# Altium schematic sheet BG1094_TopLevel.SchDoc: =project_title
size Tabloid; PageSetup: Record=PageOptions|CenterHorizontal=True|CenterVertical=True|PrintScale=0.73|XCorrection=1.00|YCorrection=1.00|PrintKind=0|BorderSize=5000000|LeftOffset=0|BottomOffset=0|Orientation=2|PaperLength=1000|PaperWidth=1000|Scale=100|PaperSource=7|PrintQuality=-4|MediaType=1|DitherType=10|PaperKind=A4|PrintScaleMode=1; CompanyName: Luxonis Holding; Organization: Luxonis Holding; Address1: 1925 Harmony Park Drive; Address2: Westminster, CO; Address3: 80234; Address4: United States; SheetNumber: 1; SheetTotal: 5
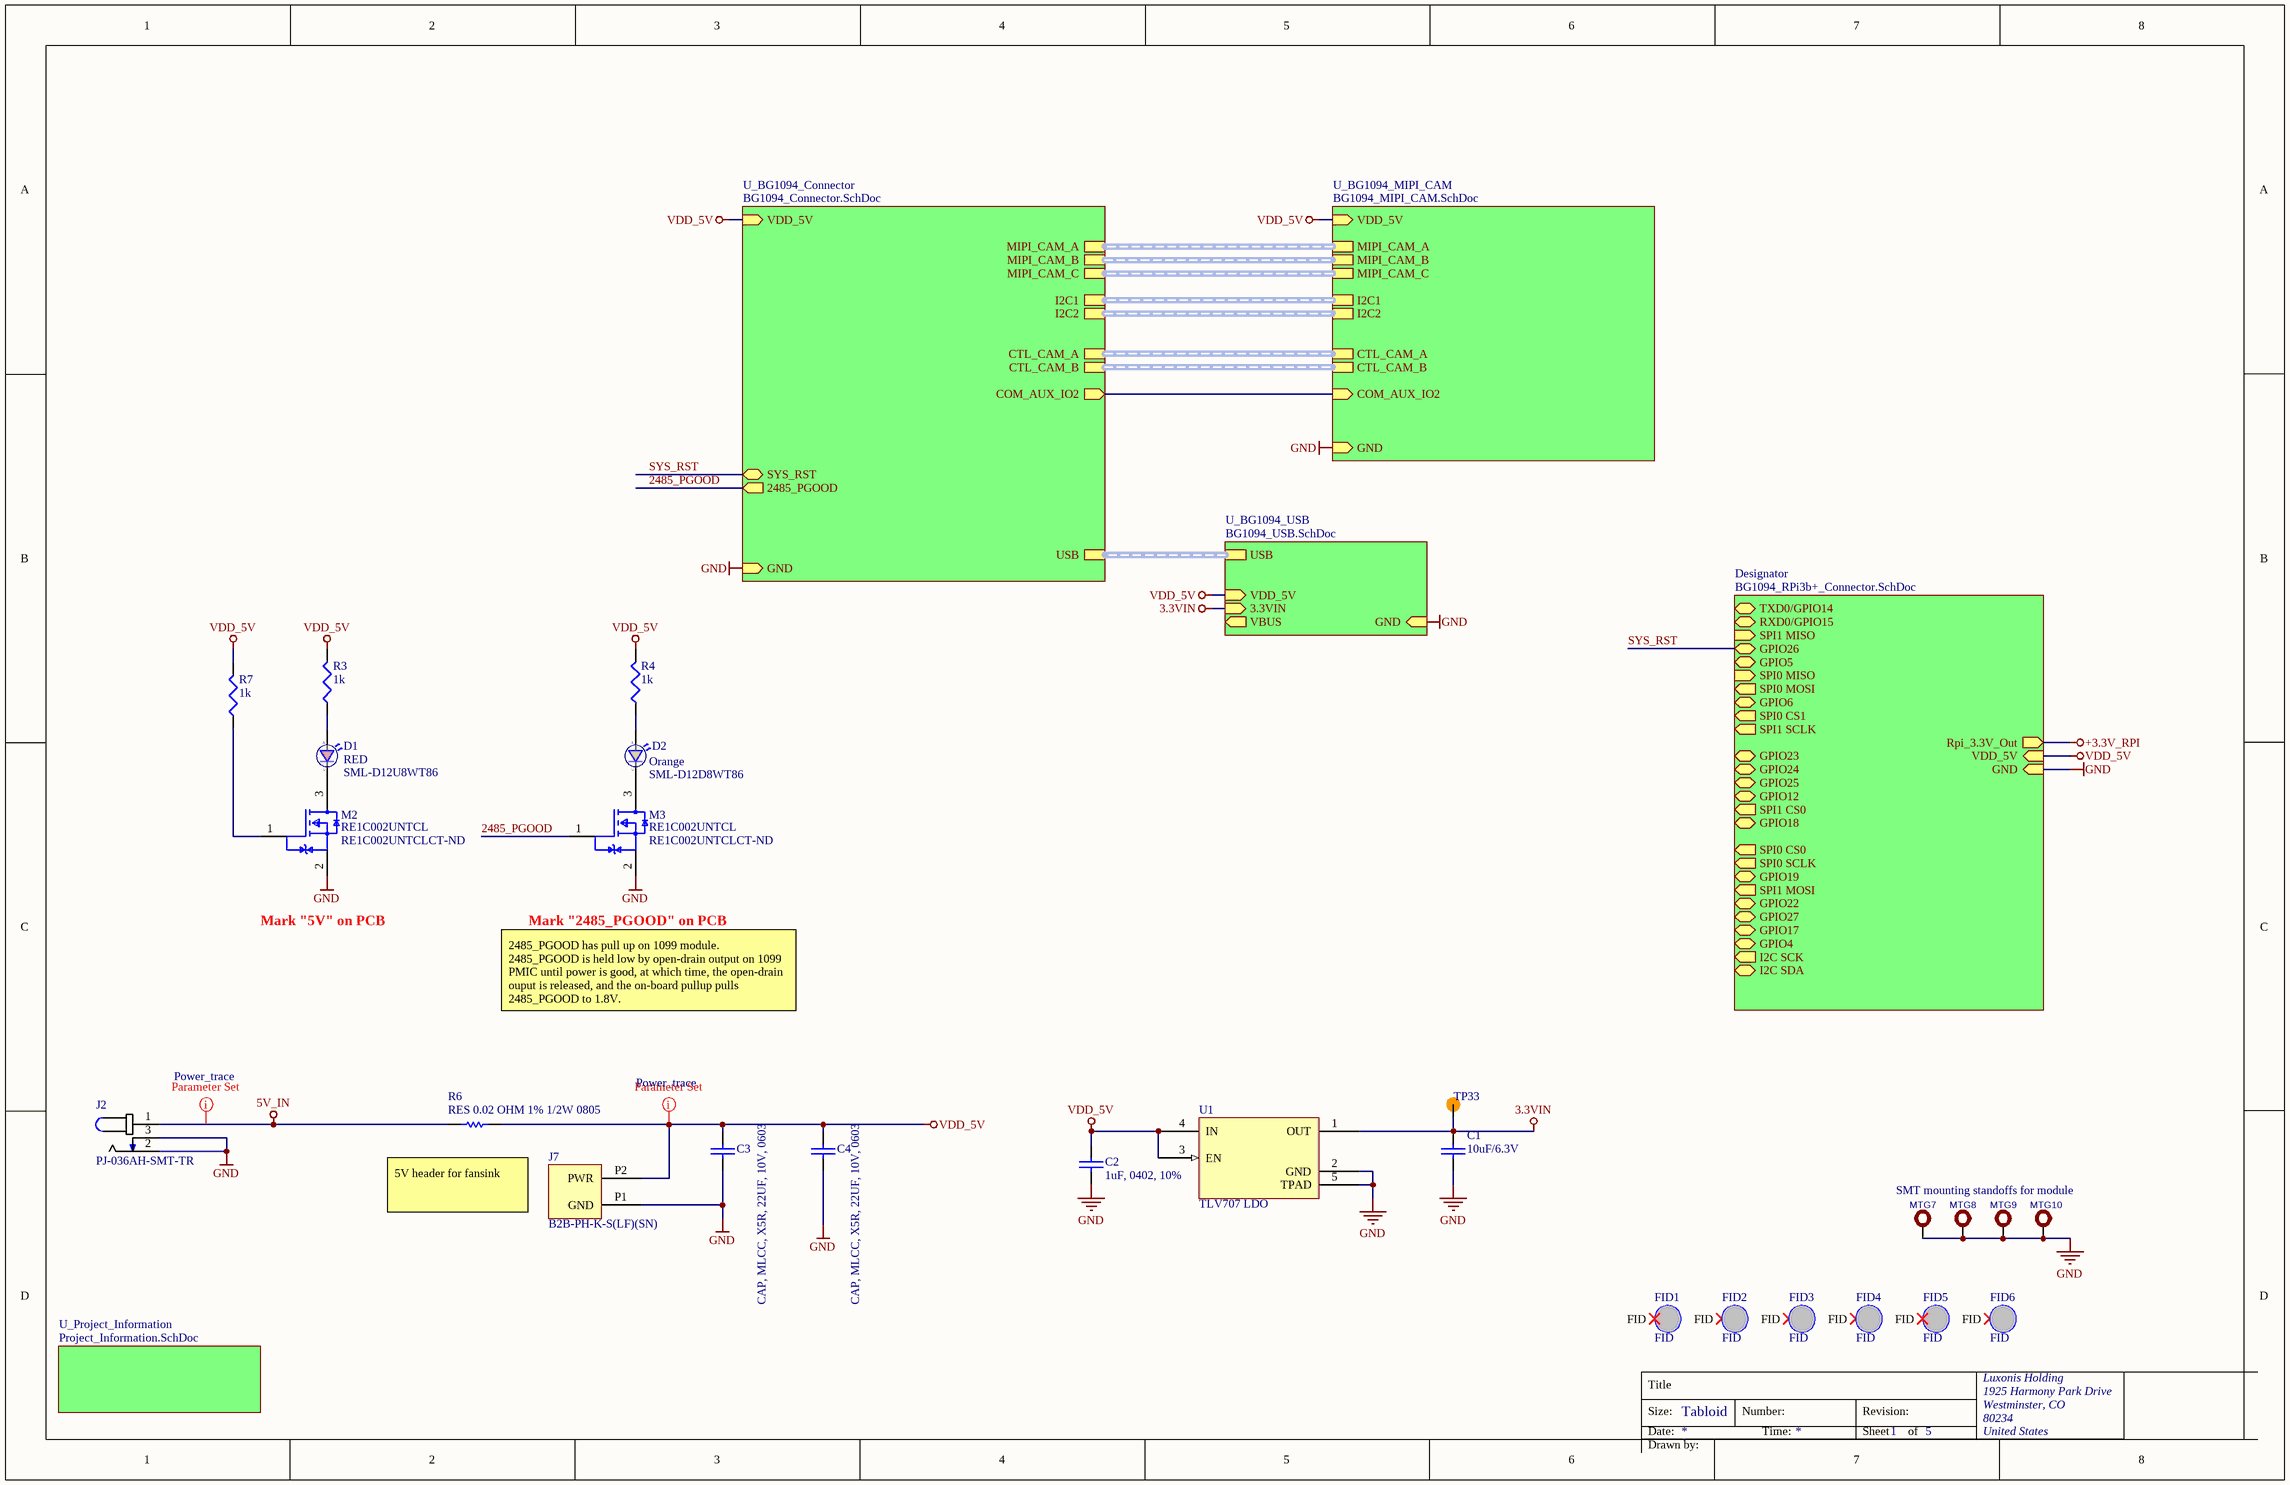
[diagram p0: BG1094_TopLevel.SchDoc]

## Parts
C1  10uF/6.3V  [CAPC0402(1005)70_N]
C2  1uF, 0402, 10%  [CAPC0402(1005)70_N]
C3  CAP, MLCC, X5R, 22UF, 10V, 0603  [CAPC0603(1608)100_N]
C4  CAP, MLCC, X5R, 22UF, 10V, 0603  [CAPC0603(1608)100_N]
D1  RED  Manufacturer Part Number 1: SML-D12U8WT86  [LED_0603]
D2  SML-D12D8WT86  Color: Orange  [LED_0603]
FID1  FID  [FIDUCIAL_1MM]  (no BOM)
FID2  FID  [FIDUCIAL_1MM]  (no BOM)
FID3  FID  [FIDUCIAL_1MM]  (no BOM)
FID4  FID  [FIDUCIAL_1MM]  (no BOM)
FID5  FID  [FIDUCIAL_1MM]  (no BOM)
FID6  FID  [FIDUCIAL_1MM]  (no BOM)
J2  PJ-036AH-SMT-TR  [CUI_PJ-036AH-SMT-TR]
J7  B2B-PH-K-S(LF)(SN)  [*JST_B2B-PH-K-S(LF)(SN)]
M2  RE1C002UNTCL  Supplier Part Number 1: RE1C002UNTCLCT-ND  [SOT-416FL]
M3  RE1C002UNTCL  Supplier Part Number 1: RE1C002UNTCLCT-ND  [SOT-416FL]
MTG7  MTG-HOLE  [STANDOFF_M2X0.4_3MM]  (value not drawn)
MTG8  MTG-HOLE  [STANDOFF_M2X0.4_3MM]  (value not drawn)
MTG9  MTG-HOLE  [STANDOFF_M2X0.4_3MM]  (value not drawn)
MTG10  MTG-HOLE  [STANDOFF_M2X0.4_3MM]  (value not drawn)
R3  1k  [RESC0402(1005)_N]
R4  1k  [RESC0402(1005)_N]
R6  RES 0.02 OHM 1% 1/2W 0805  [RESC0805(2012)_M]
R7  1k  [RESC0402(1005)_N]
TP33  TP_SMD  [TP_0.75MM_SMD_NO-SILK]  (value not drawn)  (no BOM)
U1  TLV707 LDO  [DFN65P100X40-4L]

## Sub-sheets
Designator = BG1094_RPi3b+_Connector.SchDoc: SPI1 MISO (in), GPIO26 (bidir), GPIO5 (bidir), SPI0 MISO (in), SPI0 MOSI (out), GPIO6 (bidir), SPI0 CS1 (out), SPI1 SCLK (out), GPIO23 (bidir), GPIO24 (bidir), GPIO25 (bidir), GPIO12 (bidir), SPI1 CS0 (out), GPIO18 (bidir), SPI0 CS0 (out), SPI0 SCLK (out), GPIO19 (bidir), SPI1 MOSI (out), GPIO22 (bidir), GPIO27 (bidir), GPIO17 (bidir), GPIO4 (bidir), I2C SCK (out), I2C SDA (bidir), Rpi_3.3V_Out (out), VDD_5V (in), GND (in), RXD0/GPIO15 (bidir), TXD0/GPIO14 (bidir)
U_BG1094_Connector = BG1094_Connector.SchDoc: MIPI_CAM_B (harness MIPI_CAM_B), MIPI_CAM_A (harness MIPI_CAM_A), MIPI_CAM_C (harness MIPI_CAM_C), I2C2 (harness I2C2), I2C1 (harness I2C1), SYS_RST (bidir), CTL_CAM_A (harness CTL_CAM_A), CTL_CAM_B (harness CTL_CAM_B), USB (harness USB), GND (in), VDD_5V (in), 2485_PGOOD (out), COM_AUX_IO2 (out)
U_BG1094_MIPI_CAM = BG1094_MIPI_CAM.SchDoc: MIPI_CAM_B (harness MIPI_CAM_B), I2C2 (harness I2C2), I2C1 (harness I2C1), MIPI_CAM_A (harness MIPI_CAM_A), MIPI_CAM_C (harness MIPI_CAM_C), CTL_CAM_A (harness CTL_CAM_A), CTL_CAM_B (harness CTL_CAM_B), GND (in), VDD_5V (in), COM_AUX_IO2 (in)
U_BG1094_USB = BG1094_USB.SchDoc: USB (harness USB), VBUS (out), GND (in), VDD_5V (in), 3.3VIN (in)
U_Project_Information = Project_Information.SchDoc: no entries

## Nets
3.3VIN: C1.2 TP33.1 U1.1(OUT) ; sheet U_BG1094_USB/3.3VIN
5V_IN: J2.1 R6.2
+3.3V_RPI: sheet Designator/Rpi_3.3V_Out
GND: C1.1 C2.2 C3.2 C4.2 J2.2 J2.3 J7.P1(GND) M2.2(Source) M3.2(Source) MTG7.1 MTG8.1 MTG9.1 MTG10.1 U1.2(GND) U1.5(TPAD) ; sheet U_BG1094_Connector/GND, sheet U_BG1094_MIPI_CAM/GND, sheet U_BG1094_USB/GND, sheet Designator/GND
VDD_5V: C2.1 C3.1 C4.1 J7.P2(PWR) R3.2 R4.2 R6.1 R7.2 U1.3(EN) U1.4(IN) ; sheet U_BG1094_Connector/VDD_5V, sheet U_BG1094_MIPI_CAM/VDD_5V, sheet U_BG1094_USB/VDD_5V, sheet Designator/VDD_5V
2485_PGOOD: M3.1(Gate) ; sheet U_BG1094_Connector/2485_PGOOD
SYS_RST: sheet U_BG1094_Connector/SYS_RST, sheet Designator/GPIO26
NetD1_1: D1.1(C) M2.3(Drain)
NetD1_2: D1.2(A) R3.1
NetD2_1: D2.1(C) M3.3(Drain)
NetD2_2: D2.2(A) R4.1
NetM2_1: M2.1(Gate) R7.1
(unnamed): sheet U_BG1094_Connector/COM_AUX_IO2, sheet U_BG1094_MIPI_CAM/COM_AUX_IO2

Not connected (* = marked no-connect by the designer): FID1 FID*; FID2 FID*; FID3 FID*; FID4 FID*; FID5 FID*; FID6 FID*

## Buses and harness runs
harness sheet U_BG1094_Connector/CTL_CAM_A = sheet U_BG1094_MIPI_CAM/CTL_CAM_A
harness sheet U_BG1094_Connector/CTL_CAM_B = sheet U_BG1094_MIPI_CAM/CTL_CAM_B
harness sheet U_BG1094_Connector/I2C1 = sheet U_BG1094_MIPI_CAM/I2C1
harness sheet U_BG1094_Connector/I2C2 = sheet U_BG1094_MIPI_CAM/I2C2
harness sheet U_BG1094_Connector/MIPI_CAM_A = sheet U_BG1094_MIPI_CAM/MIPI_CAM_A
harness sheet U_BG1094_Connector/MIPI_CAM_B = sheet U_BG1094_MIPI_CAM/MIPI_CAM_B
harness sheet U_BG1094_Connector/MIPI_CAM_C = sheet U_BG1094_MIPI_CAM/MIPI_CAM_C
harness sheet U_BG1094_Connector/USB = sheet U_BG1094_USB/USB

## Layout directives
net class Power_trace: 5V_IN, VDD_5V

## Notes on the sheet
- Mark "5V" on PCB
- Mark "2485_PGOOD" on PCB
- 2485_PGOOD has pull up on 1099 module. 2485_PGOOD is held low by open-drain output on 1099 PMIC until power is good, at which time, the open-drain ouput is released, and the on-board pullup pulls 2485_PGOOD to 1.8V.
- (near R6) 5V header for fansink
- SMT mounting standoffs for module
- Title
- Size:
- Date:
- Tabloid
- Number:
- Time:
- Revision:
- Sheet
- of
- Drawn by:

## Library data of the parts
C1 = CAP: SMD Multilayer Ceramic Capacitor, 0402 [1005 Metric], 10 µF, 6.3 V, ± 20%, X5R; MAN: MuRata; MAN PN: GRM155R60J106ME44D; ICCO PN: MV226007; DIST: Farnell; DIST PN: 2218854RL
C2 = CL05A105KP5NNNC: Cap Ceramic 1uF 10V X5R 10% SMD 0402 85C Paper T/R; Manufacturer: Samsung; Supplier 1: Digi-Key; Manufacturer Part Number: CL05A105KP5NNNC; Stock 1: 13690251; Pricing 1: 1 = 0.10000, 10 = 0.04200, 100 = 0.01880, 500 = 0.01340, 1000 = 0.01053, 2500 = 0.00958, 5000 = 0.00881 (USD); RoHS: Yes; Mount: Surface Mount; Case/Package: 0402; Case Code (Metric): 1005; Case Code (Imperial): 0402; Material: Ceramic; Contact Plating: Tin; Min Operating Temperature: -55°C; Max Operating Temperature: 85°C; Capacitance: 1uF; Tolerance: 10%; Packaging: Tape and Reel; Voltage Rating: 10V; Dielectric: X5R; Package Quantity: 1; Length: 1mm; Height: 0.5mm; Width: 0.02inch; Thickness: 0.022inch; Depth: 0.5mm; Radiation Hardening: No; ComponentLink1URL: https://datasheet.ciiva.com/15195/getdatasheetpartid-358390-15195630.pdf?src-supplier=Verical; ComponentLink1Description: https://datasheet.ciiva.com/15195/getdatasheetpartid-358390-15195630.pdf?src-supplier=Verical; ComponentLink2URL: https://datasheet.ciiva.com/29198/459159-da-01-en-vs-kondensator-0402-29198341.pdf?src-supplier=Conrad; ComponentLink2Description: https://datasheet.ciiva.com/29198/459159-da-01-en-vs-kondensator-0402-29198341.pdf?src-supplier=Conrad
C3 C4 = GRM188R61A226ME15D: Manufacturer 1: *
D1 = LED_RED_0603: LED RED DIFFUSED 0603 SMD; Manufacturer 1: Rohm; Lens Style: Rectangular,Diffused,Colorless; Forward Current: 20mA; Forward Voltage: 2.2V; Luminous Intensity: 63mcd; Dominant Wavelength: 620nm; Number of LEDs: 1; Viewing Angle: 160°; Lens Color: White,Clear,Diffused; Supplier 1: Digi-Key; Stock 1: 34516; Pricing 1: 1=0.33000, 10=0.23900, 100=0.11340, 500=0.07560, 1000=0.05922 (USD); Mount: Surface Mount; Case/Package: 0603; Number of Pins: 2; Case Code (Metric): 1608; Case Code (Imperial): 0603; Min Operating Temperature: -40°C; Max Operating Temperature: 85°C; Packaging: Tape and Reel; Wavelength: 620nm; Package Quantity: 1; Test Current: 20mA; Lens Transparency: Diffused; Length: 1.6mm; Height: 0.65mm; Width: 0.8mm; Radiation Hardening: No; REACH SVHC: No SVHC; Lead Free: Lead Free; ComponentLink1URL: https://datasheet.ciiva.com/11774/0900766b80df3ada-11774020.pdf?src-supplier=RSComponents; ComponentLink1Description: https://datasheet.ciiva.com/11774/0900766b80df3ada-11774020.pdf?src-supplier=RSComponents; ComponentLink2URL: https://datasheet.ciiva.com/2110/sml-d1-2110375.pdf?src-supplier=Digi-Key; ComponentLink2Description: https://datasheet.ciiva.com/2110/sml-d1-2110375.pdf?src-supplier=Digi-Key; ComponentLink3URL: https://datasheet.ciiva.com/2110/sml-d1-2110376.pdf?src-supplier=Digi-Key; ComponentLink3Description: https://datasheet.ciiva.com/2110/sml-d1-2110376.pdf?src-supplier=Digi-Key; ComponentLink4URL: https://datasheet.ciiva.com/2110/sml-d1-2110377.pdf?src-supplier=Digi-Key; ComponentLink4Description: https://datasheet.ciiva.com/2110/sml-d1-2110377.pdf?src-supplier=Digi-Key; ComponentLink5URL: https://datasheet.ciiva.com/9324/sml-d1-9324826.pdf?src-supplier=Avnet; ComponentLink5Description: https://datasheet.ciiva.com/9324/sml-d1-9324826.pdf?src-supplier=Avnet; RoHS: Yes; Color: Red; Illumination Color: Red; ComponentLink6URL: https://datasheet.ciiva.com/17420/sml-d1-17420939.pdf?src-supplier=Avnet+Europe; ComponentLink6Description: https://datasheet.ciiva.com/17420/sml-d1-17420939.pdf?src-supplier=Avnet+Europe; Supplier Part Number 1: 511-1580-1-ND
D2 = LED_ORANGE_0603: LED ORANGE DIFFUSED 0603 SMD; Manufacturer 1: Rohm; Lens Color: White; Lens Style: Diffused,Colorless,Rectangular; Dominant Wavelength: 605nm; Number of LEDs: 1; Forward Voltage: 2.2V; Viewing Angle: 160°; Forward Current: 20mA; Luminous Intensity: 100mcd; Supplier 1: Digi-Key; Stock 1: 29355; Pricing 1: 1=0.33000, 10=0.23900, 100=0.11340, 500=0.07560, 1000=0.05922 (USD); RoHS: Yes; Mount: Surface Mount; Case/Package: 0603; Number of Pins: 2; Case Code (Metric): 1608; Case Code (Imperial): 0603; Min Operating Temperature: -40°C; Max Operating Temperature: 85°C; Package Quantity: 1; Packaging: Tape and Reel; Illumination Color: Orange; Test Current: 20mA; Lens Transparency: Diffused; Wavelength: 605nm; Length: 1.6mm; Height: 0.65mm; Width: 0.8mm; Radiation Hardening: No; REACH SVHC: Unknown; Lead Free: Lead Free; ComponentLink1URL: https://datasheet.ciiva.com/2115/sml-d1-2115577.pdf?src-supplier=Digi-Key; ComponentLink1Description: https://datasheet.ciiva.com/2115/sml-d1-2115577.pdf?src-supplier=Digi-Key; ComponentLink2URL: https://datasheet.ciiva.com/2115/sml-d1-2115578.pdf?src-supplier=Digi-Key; ComponentLink2Description: https://datasheet.ciiva.com/2115/sml-d1-2115578.pdf?src-supplier=Digi-Key; ComponentLink3URL: https://datasheet.ciiva.com/3161/sml-d1-3161418.pdf?src-supplier=Avnet; ComponentLink3Description: https://datasheet.ciiva.com/3161/sml-d1-3161418.pdf?src-supplier=Avnet; ComponentLink4URL: https://datasheet.ciiva.com/16387/sml-d1-16387850.pdf?src-supplier=Future+Electronics; ComponentLink4Description: https://datasheet.ciiva.com/16387/sml-d1-16387850.pdf?src-supplier=Future+Electronics; ComponentLink5URL: https://datasheet.ciiva.com/2115/sml-d1-2115579.pdf?src-supplier=Digi-Key; ComponentLink5Description: https://datasheet.ciiva.com/2115/sml-d1-2115579.pdf?src-supplier=Digi-Key; ComponentLink6URL: https://datasheet.ciiva.com/17419/sml-d1-17419886.pdf?src-supplier=Avnet+Europe; ComponentLink6Description: https://datasheet.ciiva.com/17419/sml-d1-17419886.pdf?src-supplier=Avnet+Europe; Supplier Part Number 1: 511-1577-1-ND; Manufacturer Part Number 1: SML-D12D8WT86
FID1-FID6 = FID: Fiducial mark; MAN PN: No part on PCB; MAN: Fiducial
J2 = PJ-036AH-SMT-TR: 2.0 x 6.3 mm, 5.0 A, Horizontal, Surface Mount (SMT), Dc Power Jack Connector; Manufacturer 1: CUI; Current Rating: 5A; Gender: Male; Shielding: Unshielded; Voltage Rating: 24V; Insulation Resistance: 100MR; Number of Conductors: 2; Supplier 1: Digi-Key; Manufacturer Part Number 1: PJ-036AH-SMT-TR; Stock 1: 14194; Pricing 1: 1=1.39000, 10=1.26100, 25=1.18400, 50=1.13260, 100=1.08110 (USD); RoHS: Yes; Mount: Surface Mount; Case/Package: SMD/SMT; Color: Black; Contact Material: Brass; Contact Plating: Silver; Housing Color: Black; Housing Material: Thermoplastic; Min Operating Temperature: -25°C; Max Operating Temperature: 85°C; Package Quantity: 1000; Termination: SMD/SMT; Connector Type: Jack; Contact Gender: Male; Packaging: Tape and Reel; Orientation: Horizontal; Lead Free: Lead Free; Flammability Rating: UL94 V-0; ComponentLink1URL: http://www.mouser.com/ds/2/670/pj-036ah-smt-516063.pdf?src-supplier=Mouser; ComponentLink1Description: http://www.mouser.com/ds/2/670/pj-036ah-smt-516063.pdf?src-supplier=Mouser; ComponentLink2URL: http://www.cui.com/Product/Resource/FuturePDF/PJ-036AH-SMT.pdf?src-supplier=Future+Electronics; ComponentLink2Description: http://www.cui.com/Product/Resource/FuturePDF/PJ-036AH-SMT.pdf?src-supplier=Future+Electronics; ComponentLink3URL: https://www.cui.com/product/resource/digikeypdf/pj-036ah-smt-tr.pdf?src-supplier=Digi-Key; ComponentLink3Description: https://www.cui.com/product/resource/digikeypdf/pj-036ah-smt-tr.pdf?src-supplier=Digi-Key; Supplier Part Number 1: CP-036AHPJCT-ND
J7 = B2B-PH-K-S(LF)(SN): CONN HEADER VERT 2POS 2MM; Manufacturer: JST; Number of Positions: 2; Connector Type: Male Pin; Current Rating: 2A; Gender: Male; Contact Resistance: 20mR; Insulation Resistance: 1MR; Voltage Rating: 100V; Supplier 1: Digi-Key; Manufacturer Part Number: B2B-PH-K-S(LF)(SN); Stock 1: 216199; Pricing 1: 1 = 0.170000, 10 = 0.162000, 100 = 0.100200, 500 = 0.082880, 1000 = 0.072520, 5000 = 0.062160, 10000 = 0.060440 (USD); RoHS: Yes; Mount: Through Hole; Number of Pins: 2; Contact Plating: Tin; Color: Natural; Contact Material: Brass; Housing Material: Polyamide; Housing Color: White; Min Operating Temperature: -25°C; Max Operating Temperature: 85°C; Number of Rows: 1; Packaging: Bulk; Termination: Solder; Fastening Type: Detent; Number of Poles: 2; Number of Contacts: 2; Orientation: Straight; Max Current Rating: 2A; Max Voltage Rating (AC): 100V; Voltage Rating (AC): 100V; Working Voltage: 100V; Max Voltage Rating (DC): 100V; Length: 5.9mm; Height: 9.4mm; Pitch: 2mm; Width: 4.5mm; Contact Mating Length: 0.13inch; Depth: 4.5mm; Lead Pitch: 2mm; Lead Free: Lead Free; REACH SVHC: No SVHC; ComponentLink1URL: https://datasheet.ciiva.com/6747/80560-6747392.pdf?src-supplier=Newark; ComponentLink1Description: https://datasheet.ciiva.com/6747/80560-6747392.pdf?src-supplier=Newark; ComponentLink2URL: https://datasheet.ciiva.com/11746/0900766b8082f551-11746676.pdf?src-supplier=RSComponents; ComponentLink2Description: https://datasheet.ciiva.com/11746/0900766b8082f551-11746676.pdf?src-supplier=RSComponents; ComponentLink3URL: https://datasheet.ciiva.com/8052/80560-8052022.pdf?src-supplier=Element14; ComponentLink3Description: https://datasheet.ciiva.com/8052/80560-8052022.pdf?src-supplier=Element14; ComponentLink4URL: https://datasheet.ciiva.com/712/eph-712442.pdf?src-supplier=Digi-Key; ComponentLink4Description: https://datasheet.ciiva.com/712/eph-712442.pdf?src-supplier=Digi-Key; ComponentLink5URL: https://datasheet.ciiva.com/16422/b2b-ph-k-slfsn-16422715.pdf?src-supplier=Future+Electronics; ComponentLink5Description: https://datasheet.ciiva.com/16422/b2b-ph-k-slfsn-16422715.pdf?src-supplier=Future+Electronics; Supplier Part Number 1: 455-1704-ND
M2 M3 = RE1C002UNTCL: MOSFET N-CH 20V 0.2A EMT3; Manufacturer 1: Rohm; Continuous Drain Current (ID): 200mA; Rds On Max: 1.2R; Input Capacitance: 25pF; Max Power Dissipation: 150mW; Supplier 1: Digi-Key; Manufacturer Part Number 1: RE1C002UNTCL; Stock 1: 941425; Pricing 1: 1=0.20000, 10=0.18200, 100=0.09930, 500=0.06112, 1000=0.04167 (USD); RoHS: Yes; Mount: Surface Mount; Case/Package: SOT-89; Packaging: Tape and Reel; Drain to Source Voltage (Vdss): 20V; Lead Free: Lead Free; ComponentLink1URL: http://www.mouser.com/ds/2/348/re1c002untcl-e-1018231.pdf?src-supplier=Mouser; ComponentLink1Description: http://www.mouser.com/ds/2/348/re1c002untcl-e-1018231.pdf?src-supplier=Mouser; ComponentLink2URL: http://rohmfs.rohm.com/en/techdata_basic/transistor/taping/EMT3_TL_taping.pdf?src-supplier=Digi-Key; ComponentLink2Description: http://rohmfs.rohm.com/en/techdata_basic/transistor/taping/EMT3_TL_taping.pdf?src-supplier=Digi-Key; ComponentLink3URL: http://rohmfs.rohm.com/en/products/databook/datasheet/discrete/transistor/mosfet/re1c002un.pdf?src-supplier=Avnet; ComponentLink3Description: http://rohmfs.rohm.com/en/products/databook/datasheet/discrete/transistor/mosfet/re1c002un.pdf?src-supplier=Avnet; ComponentLink4URL: https://www.rohm.com/datasheet/RE1C002UN/re1c002untcl-e?src-supplier=Digi-Key; ComponentLink4Description: https://www.rohm.com/datasheet/RE1C002UN/re1c002untcl-e?src-supplier=Digi-Key; ComponentLink5URL: http://www.farnell.com/datasheets/2704376.pdf?src-supplier=Newark; ComponentLink5Description: http://www.farnell.com/datasheets/2704376.pdf?src-supplier=Newark
MTG7-MTG10 = MTG-HOLE_B: Mounting Hole; B - Value: Not a Part; A - Level: 0; Z - SMD or PTH: PTH; F - MFG P/N: Not a Part; D - my Footprint: STANDOFF_M2X0.4_3MM
R3 R4 R7 = RES1: SMD Chip Resistor, 1 kohm, 50 V, 0402 [1005 Metric], 62.5 mW, ± 1%
R6 = D-100-0004
TP33 = TP_SMD: circular pad test point, SMD
U1 = TLV707: IC REG LDO 1V 0.2A 4X2SON; Manufacturer: Texas Instruments; Manufacturer Part Number: TLV70710DQNR; Output Current: 200mA; Number of Regulators: 1; Min Current Limit: 240mA; Quiescent Current: 25uA; Dropout Voltage: 250mV; Supplier 1: Digi-Key; Stock 1: 4380; Pricing 1: 1 = 0.46000, 10 = 0.37300, 100 = 0.25380, 500 = 0.19034, 1000 = 0.14276 (USD); RoHS: Yes; Mount: Surface Mount; Min Operating Temperature: -40°C; Max Operating Temperature: 125°C; Packaging: Tape and Reel; Package Quantity: 3000; Output Voltage: 1V; Lead Free: Lead Free; ComponentLink1URL: http://www.ti.com/lit/gpn/tlv707?src-supplier=Mouser; ComponentLink1Description: http://www.ti.com/lit/gpn/tlv707?src-supplier=Mouser; ComponentLink2URL: http://www.ti.com/lit/ds/symlink/tlv707.pdf?src-supplier=Digi-Key; ComponentLink2Description: http://www.ti.com/lit/ds/symlink/tlv707.pdf?src-supplier=Digi-Key